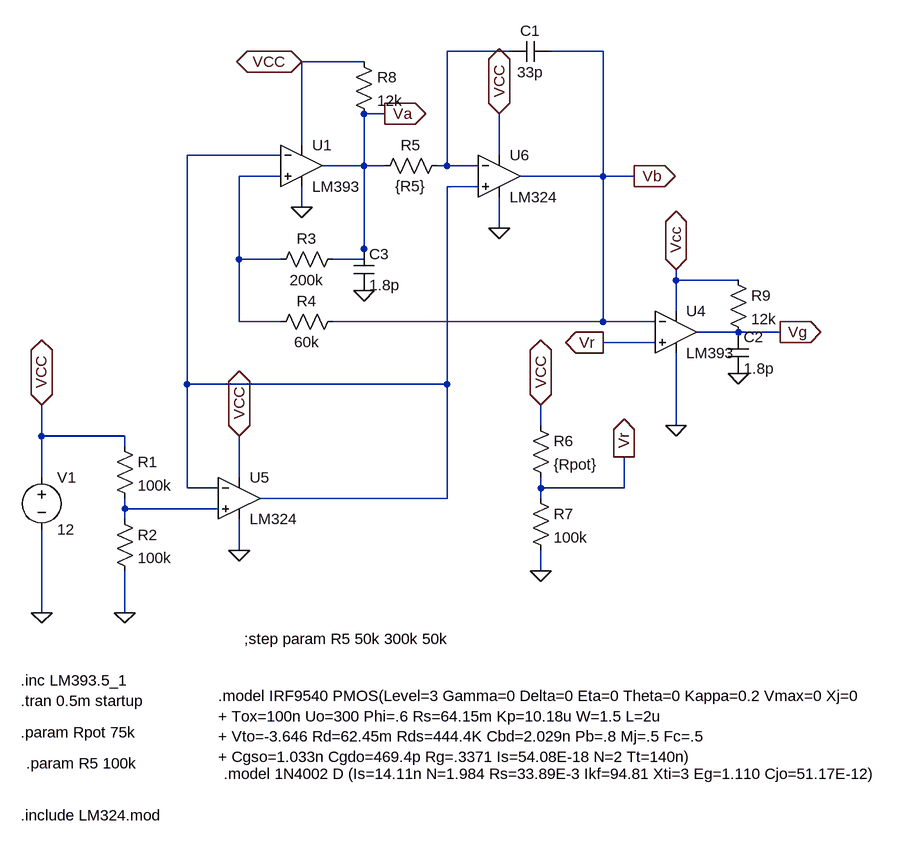
[diagram p0: schematic pwm_triangular.asc]
pwm_triangular.asc, the LTspice schematic file:
Version 4.1
SHEET 1 2200 680
WIRE -32 -912 -128 -912
WIRE 112 -912 32 -912
WIRE -256 -896 -352 -896
WIRE -224 -816 -256 -816
WIRE -352 -768 -352 -896
WIRE -384 -752 -528 -752
WIRE -48 -752 -48 -816
WIRE -256 -736 -256 -816
WIRE -256 -736 -320 -736
WIRE -224 -736 -256 -736
WIRE -128 -736 -128 -912
WIRE -128 -736 -144 -736
WIRE -80 -736 -128 -736
WIRE -384 -720 -448 -720
WIRE 112 -720 112 -912
WIRE 112 -720 -16 -720
WIRE 160 -720 112 -720
WIRE -80 -704 -128 -704
WIRE -352 -672 -352 -704
WIRE -48 -640 -48 -688
WIRE -256 -608 -256 -736
WIRE -448 -592 -448 -720
WIRE -384 -592 -448 -592
WIRE -256 -592 -256 -608
WIRE -256 -592 -304 -592
WIRE 224 -560 224 -576
WIRE 320 -560 224 -560
WIRE 224 -512 224 -560
WIRE -448 -496 -448 -592
WIRE -384 -496 -448 -496
WIRE 112 -496 112 -720
WIRE 112 -496 -304 -496
WIRE 192 -496 112 -496
WIRE 320 -480 256 -480
WIRE 384 -480 320 -480
WIRE 192 -464 112 -464
WIRE -528 -400 -528 -752
WIRE -128 -400 -128 -704
WIRE -128 -400 -528 -400
WIRE 16 -336 16 -368
WIRE 224 -336 224 -448
WIRE -752 -320 -752 -368
WIRE -624 -320 -752 -320
WIRE -624 -304 -624 -320
WIRE -752 -256 -752 -320
WIRE -448 -256 -448 -320
WIRE -528 -240 -528 -400
WIRE -480 -240 -528 -240
WIRE 16 -240 16 -256
WIRE 144 -240 144 -288
WIRE 144 -240 16 -240
WIRE -128 -224 -128 -400
WIRE -128 -224 -416 -224
WIRE 16 -224 16 -240
WIRE -624 -208 -624 -224
WIRE -480 -208 -624 -208
WIRE -624 -192 -624 -208
WIRE -448 -144 -448 -192
WIRE 16 -112 16 -144
WIRE -752 -48 -752 -176
WIRE -624 -48 -624 -112
FLAG -624 -48 0
FLAG -752 -48 0
FLAG -48 -640 0
FLAG -448 -144 0
FLAG 224 -336 0
FLAG -352 -672 0
FLAG -752 -368 VCC
IOPIN -752 -368 BiDir
FLAG -352 -896 VCC
IOPIN -352 -896 BiDir
FLAG -48 -816 VCC
IOPIN -48 -816 BiDir
FLAG -448 -320 VCC
IOPIN -448 -320 BiDir
FLAG -224 -816 Va
IOPIN -224 -816 Out
FLAG 160 -720 Vb
IOPIN 160 -720 Out
FLAG 224 -576 Vcc
IOPIN 224 -576 BiDir
FLAG 384 -480 Vg
IOPIN 384 -480 Out
FLAG 16 -368 VCC
IOPIN 16 -368 BiDir
FLAG 16 -112 0
FLAG 144 -288 Vr
IOPIN 144 -288 Out
FLAG 112 -464 Vr
IOPIN 112 -464 Out
FLAG 320 -416 0
FLAG -256 -544 0
SYMBOL res -128 -752 R90
WINDOW 0 0 56 VBottom 2
WINDOW 3 32 56 VTop 2
SYMATTR InstName R5
SYMATTR Value {R5}
SYMBOL res -640 -320 R0
SYMATTR InstName R1
SYMATTR Value 100k
SYMBOL res -640 -208 R0
SYMATTR InstName R2
SYMATTR Value 100k
SYMBOL voltage -752 -272 R0
SYMATTR InstName V1
SYMATTR Value 12
SYMBOL res -288 -608 R90
WINDOW 0 0 56 VBottom 2
WINDOW 3 32 56 VTop 2
SYMATTR InstName R3
SYMATTR Value 200k
SYMBOL res -288 -512 R90
WINDOW 0 0 56 VBottom 2
WINDOW 3 32 56 VTop 2
SYMATTR InstName R4
SYMATTR Value 60k
SYMBOL cap 32 -928 R90
WINDOW 0 0 32 VBottom 2
WINDOW 3 32 32 VTop 2
SYMATTR InstName C1
SYMATTR Value 33p
SYMBOL res 0 -352 R0
SYMATTR InstName R6
SYMATTR Value {Rpot}
SYMBOL res 0 -240 R0
SYMATTR InstName R7
SYMATTR Value 100k
SYMBOL OpAmps\\opamp2 -352 -800 R0
SYMATTR InstName U1
SYMATTR Value LM393
SYMBOL res -272 -912 R0
SYMATTR InstName R8
SYMATTR Value 12k
SYMBOL OpAmps\\opamp2 224 -544 R0
SYMATTR InstName U4
SYMATTR Value LM393
SYMBOL res 304 -576 R0
SYMATTR InstName R9
SYMATTR Value 12k
SYMBOL cap 304 -480 R0
SYMATTR InstName C2
SYMATTR Value 1.8p
SYMBOL cap -272 -608 R0
SYMATTR InstName C3
SYMATTR Value 1.8p
SYMBOL OpAmps\\opamp2 -448 -288 R0
SYMATTR InstName U5
SYMATTR Value LM324
SYMBOL OpAmps\\opamp2 -48 -784 R0
SYMATTR InstName U6
SYMATTR Value LM324
TEXT -784 88 Left 2 !.tran 0.5m startup
TEXT -480 80 Left 2 !.model IRF9540 PMOS(Level=3 Gamma=0 Delta=0 Eta=0 Theta=0 Kappa=0.2 Vmax=0 Xj=0\n+ Tox=100n Uo=300 Phi=.6 Rs=64.15m Kp=10.18u W=1.5 L=2u\n+ Vto=-3.646 Rd=62.45m Rds=444.4K Cbd=2.029n Pb=.8 Mj=.5 Fc=.5\n+ Cgso=1.033n Cgdo=469.4p Rg=.3371 Is=54.08E-18 N=2 Tt=140n)
TEXT -472 200 Left 2 !.model 1N4002 D (Is=14.11n N=1.984 Rs=33.89E-3 Ikf=94.81 Xti=3 Eg=1.110 Cjo=51.17E-12)
TEXT -784 136 Left 2 !.param Rpot 75k
TEXT -784 56 Left 2 !.inc LM393.5_1
TEXT -440 -8 Left 2 !;step param R5 50k 300k 50k
TEXT -776 184 Left 2 !.param R5 100k
TEXT -784 264 Left 2 !.include LM324.mod

The netlist it stands for:
* pwm_triangular.asc
R5 N001 Va {R5}
R1 VCC N004 100k
R2 N004 0 100k
V1 VCC 0 12
R3 Va N003 200k
R4 Vb N003 60k
C1 Vb N001 33p
R6 VCC Vr {Rpot}
R7 Vr 0 100k
X§U1 N003 N002 VCC 0 Va LM393  ; pins In+ In- V+ V- OUT
R8 VCC Va 12k
X§U4 Vr Vb VCC 0 Vg LM393  ; pins In+ In- V+ V- OUT
R9 VCC Vg 12k
C2 Vg 0 1.8p
C3 Va 0 1.8p
X§U5 N004 N002 VCC 0 N002 LM324  ; pins In+ In- V+ V- OUT
X§U6 N002 N001 VCC 0 Vb LM324  ; pins In+ In- V+ V- OUT
.tran 0.5m startup
.model IRF9540 PMOS(Level=3 Gamma=0 Delta=0 Eta=0 Theta=0 Kappa=0.2 Vmax=0 Xj=0
+ Tox=100n Uo=300 Phi=.6 Rs=64.15m Kp=10.18u W=1.5 L=2u
+ Vto=-3.646 Rd=62.45m Rds=444.4K Cbd=2.029n Pb=.8 Mj=.5 Fc=.5
+ Cgso=1.033n Cgdo=469.4p Rg=.3371 Is=54.08E-18 N=2 Tt=140n)
.model 1N4002 D (Is=14.11n N=1.984 Rs=33.89E-3 Ikf=94.81 Xti=3 Eg=1.110 Cjo=51.17E-12)
.param Rpot 75k
.inc LM393.5_1
;step param R5 50k 300k 50k
.param R5 100k
.include LM324.mod
.backanno
.end